# EasyEDA schematic Schema.json
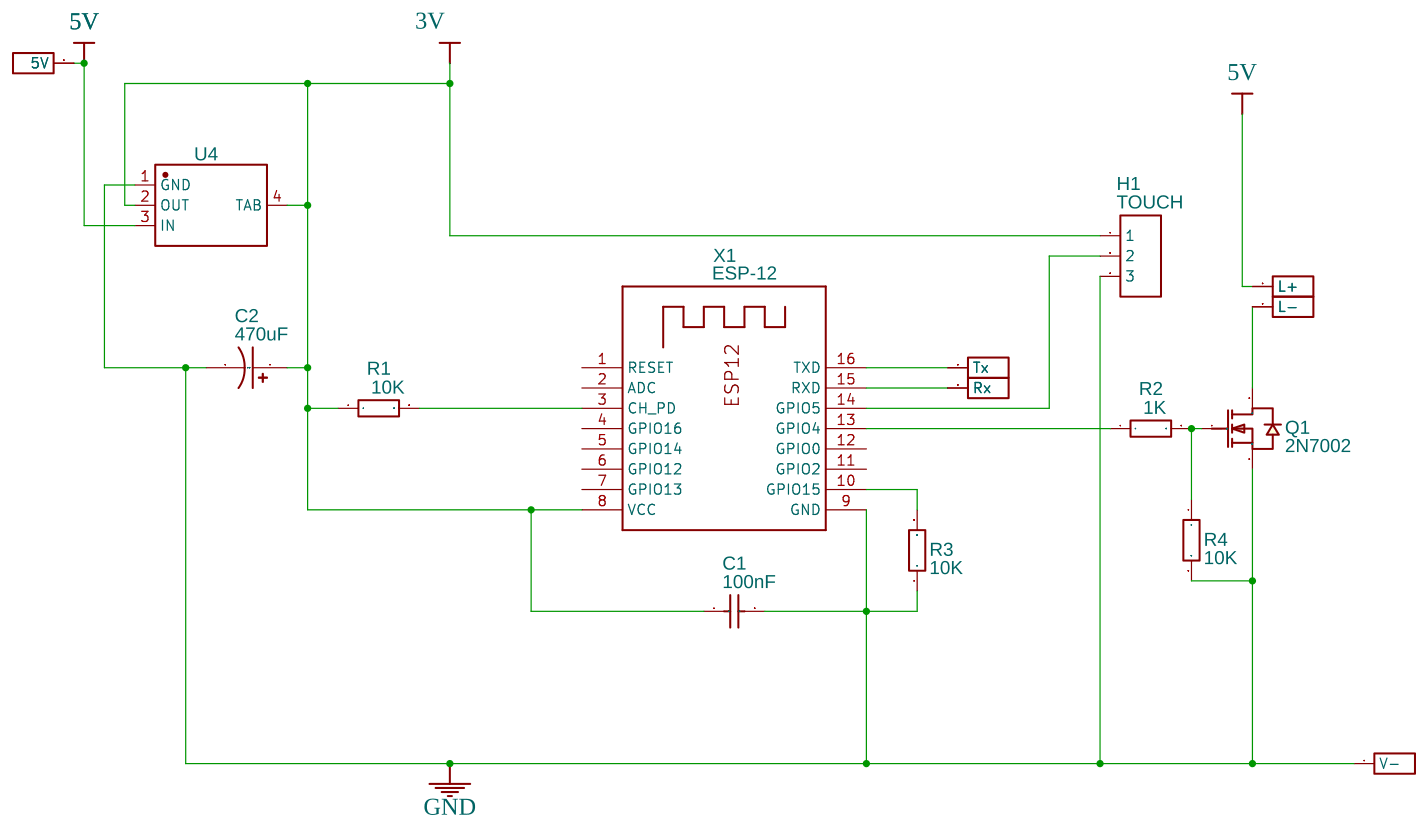
[diagram p0: schematic sheet]

## Parts
C1  100nF  [C0603]
C2  470uF  [C2917]
H1  TOUCH  [HDR-F-2.54_1X3]
J1  HDR-M-2.54_1x1  [HDR-M-2.54_1X1]
J2  HDR-M-2.54_1x1  [HDR-M-2.54_1X1]
J3  HDR-M-2.54_1x1  [HDR-M-2.54_1X1]
J4  HDR-M-2.54_1x1  [HDR-M-2.54_1X1]
J5  HDR-M-2.54_1x1  [HDR-M-2.54_1X1]
J6  HDR-M-2.54_1x1  [HDR-M-2.54_1X1]
Q1  2N7002  [SOT-23_L2.9-W1.3-P0.95-LS2.4-BR]
R1  10K  [R0603]
R2  1K  [R0603]
R3  10K  [R0603]
R4  10K  [R0603]
U4  LT1117IST-2.85#TRPBF  [SOT-223-3_L6.5-W3.4-P2.30-LS7.0-BR]
X1  ESP-12  [ESP12LARGE]

## Library data of the parts
C1 = CL10B104JB8NNNC: Supplier: LCSC; Manufacturer: SAMSUNG; Supplier Part: C24452; LCSC Assembly: Yes; SMT Type: Extend
C2 = A700V106M12RATE040: Supplier: LCSC; Supplier Part: C2162687; Manufacturer: KEMET(基美); Contributor: LCSC; JLCPCB Part Class: Extended Part
H1 = HDR-F-2.54_1x3: Supplier Part: C146690; Supplier: LCSC; Contributor: LCEDA_Lib
J1-J6 = HDR-M-2.54_1x1: Supplier Part: C81276; Supplier: LCSC; Contributor: LCEDA_Lib
Q1 = 2N7002: Supplier: LCSC; Manufacturer: Nexperia; Manufacturer Part: 2N7002,215; image: //image.lceda.cn/szlcsc/C65189.jpg; Supplier Part: C65189; Paste Type: expand; Contributor: LCEDA_Lib
R1-R4 = RK73B1JTTD103J: Supplier: LCSC; Manufacturer: KOA; Contributor: LCSC; Supplier Part: C159891
U4 = LT1117IST-2.85#TRPBF: Supplier: LCSC; Supplier Part: C661272; Manufacturer: Analog Devices; Contributor: LCSC
X1 = ESP-12: Contributor: Adafruit

## Nets
3V: C1.1 C2.1 H1.1 R1.1 U4.2(OUT) U4.4(TAB) X1.8(VCC)
5V: J2.1(5V) J5.1(L+) U4.3(IN)
GND: C1.2 C2.2 H1.3 J1.1(V-) Q1.2(S) R3.1 R4.2 U4.1(GND) X1.9(GND)
Net-(H1-2): H1.2 X1.14(GPIO5)
Net-(J3-1): J3.1(Tx) X1.16(TXD)
Net-(J4-1): J4.1(Rx) X1.15(RXD)
Net-(J6-1): J6.1(L-) Q1.3(D)
Net-(Q1-1): Q1.1(G) R2.2 R4.1
Net-(R1-2): R1.2 X1.3(CH_PD)
Net-(R2-1): R2.1 X1.13(GPIO4)
Net-(R3-2): R3.2 X1.10(GPIO15)

Not connected (* = marked no-connect by the designer): X1 1(RESET) 2(ADC) 4(GPIO16) 5(GPIO14) 6(GPIO12) 7(GPIO13) 11(GPIO2) 12(GPIO0)
